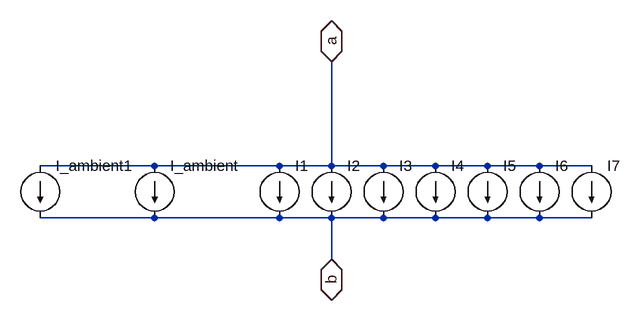
[diagram p0: schematic PDo.asc]
PDo.asc, the LTspice schematic file:
Version 4
SHEET 1 880 680
WIRE -64 80 -240 80
WIRE 128 80 -64 80
WIRE 208 80 208 -80
WIRE 208 80 128 80
WIRE 288 80 208 80
WIRE 368 80 288 80
WIRE 448 80 368 80
WIRE 528 80 448 80
WIRE 608 80 528 80
WIRE -64 160 -240 160
WIRE 128 160 -64 160
WIRE 208 160 128 160
WIRE 288 160 208 160
WIRE 368 160 288 160
WIRE 448 160 368 160
WIRE 528 160 448 160
WIRE 608 160 528 160
WIRE 208 224 208 160
FLAG 208 -80 a
IOPIN 208 -80 BiDir
FLAG 208 224 b
IOPIN 208 224 BiDir
SYMBOL current 128 80 R0
WINDOW 3 24 80 Invisible 2
WINDOW 123 0 0 Left 0
WINDOW 39 0 0 Left 0
SYMATTR Value PULSE(0 100n 1m 4.5u 7u 50u 500u 5)
SYMATTR InstName I1
SYMBOL current 208 80 R0
WINDOW 3 24 80 Invisible 2
WINDOW 123 0 0 Left 0
WINDOW 39 0 0 Left 0
SYMATTR Value PULSE(0 100n 6m 4.5u 7u 50u 500u 5)
SYMATTR InstName I2
SYMBOL current 288 80 R0
WINDOW 3 24 80 Invisible 2
WINDOW 123 0 0 Left 0
WINDOW 39 0 0 Left 0
SYMATTR Value PULSE(0 100n 11m 4.5u 7u 50u 500u 7)
SYMATTR InstName I3
SYMBOL current -64 80 R0
WINDOW 3 24 80 Invisible 2
WINDOW 123 0 0 Left 0
WINDOW 39 0 0 Left 0
SYMATTR Value SINE(500n 25n 100 0 0 0 10)
SYMATTR InstName I_ambient
SYMBOL current 368 80 R0
WINDOW 3 24 80 Invisible 2
WINDOW 123 0 0 Left 0
WINDOW 39 0 0 Left 0
SYMATTR Value PULSE(0 0 16m 4.5u 7u 50u 500u 7)
SYMATTR InstName I4
SYMBOL current 448 80 R0
WINDOW 3 24 80 Invisible 2
WINDOW 123 0 0 Left 0
WINDOW 39 0 0 Left 0
SYMATTR Value PULSE(0 100n 21m 4.5u 7u 50u 500u 5)
SYMATTR InstName I5
SYMBOL current 528 80 R0
WINDOW 3 24 80 Invisible 2
WINDOW 123 0 0 Left 0
WINDOW 39 0 0 Left 0
SYMATTR Value PULSE(0 100n 26m 4.5u 7u 50u 500u 5)
SYMATTR InstName I6
SYMBOL current 608 80 R0
WINDOW 3 24 80 Invisible 2
WINDOW 123 0 0 Left 0
WINDOW 39 0 0 Left 0
SYMATTR Value PULSE(0 100n 31m 4.5u 7u 50u 500u 5)
SYMATTR InstName I7
SYMBOL current -240 80 R0
WINDOW 3 24 80 Invisible 2
WINDOW 123 0 0 Left 0
WINDOW 39 0 0 Left 0
SYMATTR Value SINE(0 10n 273 0 0 0 10)
SYMATTR InstName I_ambient1

The netlist it stands for:
* PDo.asc
I1 a b PULSE(0 100n 1m 4.5u 7u 50u 500u 5)
I2 a b PULSE(0 100n 6m 4.5u 7u 50u 500u 5)
I3 a b PULSE(0 100n 11m 4.5u 7u 50u 500u 7)
I_ambient a b SINE(500n 25n 100 0 0 0 10)
I4 a b PULSE(0 0 16m 4.5u 7u 50u 500u 7)
I5 a b PULSE(0 100n 21m 4.5u 7u 50u 500u 5)
I6 a b PULSE(0 100n 26m 4.5u 7u 50u 500u 5)
I7 a b PULSE(0 100n 31m 4.5u 7u 50u 500u 5)
I_ambient1 a b SINE(0 10n 273 0 0 0 10)
.backanno
.end